# EasyEDA Pro project TY_FC_CONTRAL_9.eprj

# Schematic Schematic1
Board Name: Board1; Create Date: 2026-02-12; Page Name: P1; Project Name: TY_FC_CONTRAL_9; Schematic Name: Schematic1; Update Date: 2026-04-08; Company: 嘉立创EDA; Page Size: A4; Version: V1.0
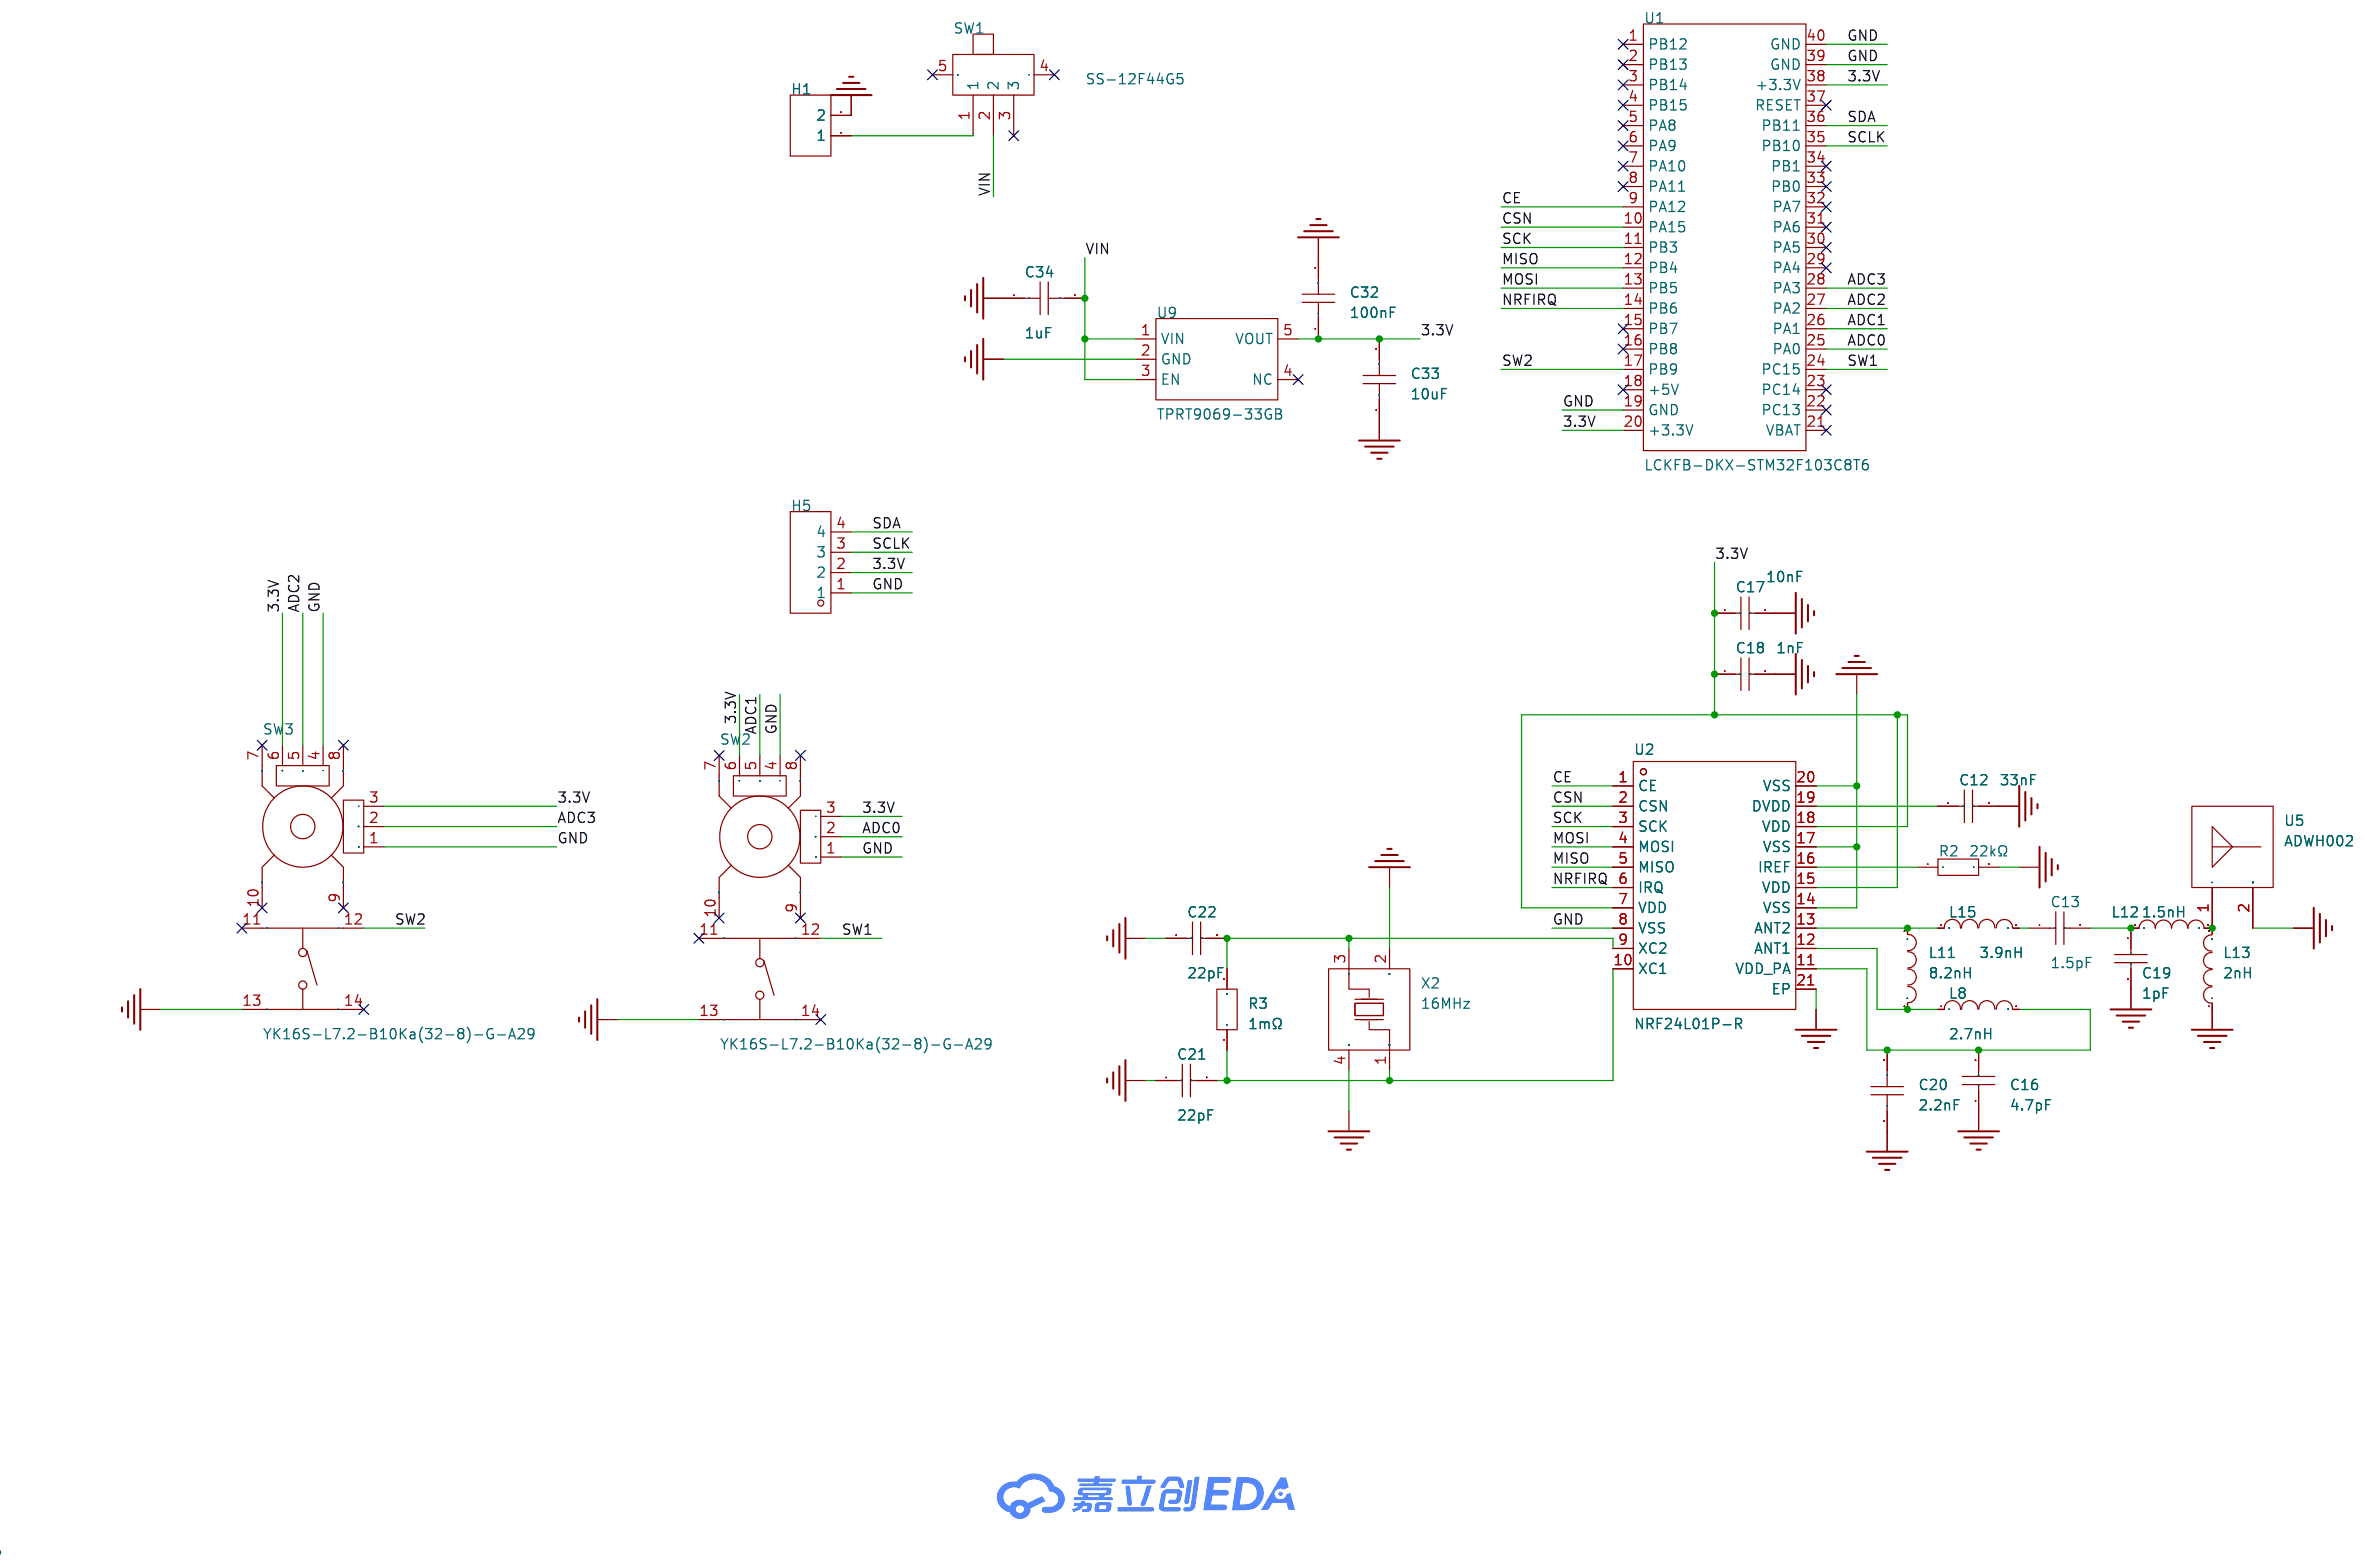
[diagram p0: schematic sheet]

## Parts
C12  33nF  [C0603]
C13  1.5pF  [C0603]
C16  4.7pF  [C0603]
C17  10nF  [C0603]
C18  1nF  [C0603]
C19  1pF  [C0603]
C20  2.2nF  [C0603]
C21  22pF  [C0603]
C22  22pF  [C0603]
C32  100nF  [C0603]
C33  10uF  [C0603]
C34  1uF  [C0603]
H1  -  [HDR-TH_2P-P2.54-V-F]
H5  -  [HDR-TH_4P-P2.54-V-F]
L8  2.7nH  [L0402]
L11  8.2nH  [L0402]
L12  1.5nH  [L0603]
L13  2nH  [L0603]
L15  3.9nH  [L0402]
R2  22kΩ  [R0603]
R3  1mΩ  [R0603]
SW1  SS-12F44G5  [SW-TH_SS-12F44G5]
SW2  YK16S-L7.2-B10Ka(32-8)-G-A29  [JOYTICK-TH_YF16S-FL7.2-B5KB-45-10-Y_1]
SW3  YK16S-L7.2-B10Ka(32-8)-G-A29  [JOYTICK-TH_YF16S-FL7.2-B5KB-45-10-Y_1]
U1  LCKFB-DKX-STM32F103C8T6  [CONN-TH_L53.3-W22.9_STM32F103C8T6-CARD]
U2  NRF24L01P-R  [QFN-20_L4.0-W4.0-P0.50-BL-EP]
U5  ADWH002  [ANT-SMD_L5.0-W2.0_HM5B]
U9  TPRT9069-33GB  [SOT-23-5_L3.0-W1.7-P0.95-LS2.8-BR]
X2  16MHz  [OSC-SMD_4P-L3.2-W2.5-BL]

## Library data of the parts
C12 = CL10B333KB8NNNC: 容值:33nF;精度:±10%;额定电压:50V;温度系数:X7R;; LCSC Part Name: 33nF ±10% 50V; Supplier Part: C21117; Manufacturer: SAMSUNG(三星); Supplier Footprint: 0603; JLCPCB Part Class: 基础库; Datasheet: https://item.szlcsc.com/datasheet/CL10B333KB8NNNC/21829.html; Supplier: LCSC; Tolerance: ±10%; Voltage Rating: 50V; Temperature Coefficient: X7R
C13 = 0603CG1R5C500NT: 容值:1.5pF;额定电压:50V;温度系数:C0G;; LCSC Part Name: ±0.25pF 1.5pF 50V; Supplier Part: C1639; Manufacturer: FH(风华); Supplier Footprint: 0603; JLCPCB Part Class: 扩展库; Datasheet: https://item.szlcsc.com/datasheet/0603CG1R5C500NT/1991.html; Supplier: LCSC; Voltage Rating: 50V; Temperature Coefficient: C0G
C16 = 0603CG4R7C500NT: 容值:4.7pF;额定电压:50V;温度系数:C0G;; LCSC Part Name: ±0.25pF 4.7pF 50V; Supplier Part: C1669; Manufacturer: FH(风华); Supplier Footprint: 0603; JLCPCB Part Class: 扩展库; Datasheet: https://item.szlcsc.com/datasheet/0603CG4R7C500NT/2021.html; Supplier: LCSC; Voltage Rating: 50V; Temperature Coefficient: C0G
C17 = CC0603KRX7R9BB103: 容值:10nF;精度:±10%;额定电压:50V;温度系数:X7R;; LCSC Part Name: 10nF ±10% 50V; Supplier Part: C100042; Manufacturer: YAGEO(国巨); Supplier Footprint: 0603; JLCPCB Part Class: 扩展库; Datasheet: https://item.szlcsc.com/datasheet/CC0603KRX7R9BB103/101256.html; Supplier: LCSC; Tolerance: ±10%; Voltage Rating: 50V; Temperature Coefficient: X7R
C18 = CL10B102KB8NNNC: 容值:1nF;精度:±10%;额定电压:50V;温度系数:X7R;; LCSC Part Name: 1nF ±10% 50V; Supplier Part: C1588; Manufacturer: SAMSUNG(三星); Supplier Footprint: 0603; JLCPCB Part Class: 基础库; Datasheet: https://item.szlcsc.com/datasheet/CL10B102KB8NNNC/1940.html; Supplier: LCSC; Tolerance: ±10%; Voltage Rating: 50V; Temperature Coefficient: X7R
C19 = 0603CG1R0C500NT: LCSC Part Name: ±0.25pF 1pF 50V; Supplier Part: C37117; Manufacturer: FH(风华); Supplier Footprint: 0603; JLCPCB Part Class: 扩展库; Datasheet: https://item.szlcsc.com/datasheet/0603CG1R0C500NT/38096.html; Supplier: LCSC; Voltage Rating: 50V; Temperature Coefficient: C0G
C20 = FCC0603B222K500CT: LCSC Part Name: 2.2nF ±10% 50V; Supplier Part: C5137562; Manufacturer: FOJAN(富捷); Supplier Footprint: 0603; JLCPCB Part Class: 扩展库; Datasheet: https://item.szlcsc.com/datasheet/FCC0603B222K500CT/5747014.html; Supplier: LCSC; Tolerance: ±10%; Voltage Rating: 50V; Temperature Coefficient: X7R
C21 C22 = CL10C220JB8NNNC: LCSC Part Name: 22pF ±5% 50V; Supplier Part: C1653; Manufacturer: SAMSUNG(三星); Supplier Footprint: 0603; JLCPCB Part Class: 基础库; Datasheet: https://item.szlcsc.com/datasheet/CL10C220JB8NNNC/2005.html; Supplier: LCSC; Tolerance: ±5%; Voltage Rating: 50V; Temperature Coefficient: C0G
C32 = CC0603KRX7R9BB104: 容值:100nF;精度:±10%;额定电压:50V;温度系数:X7R;; LCSC Part Name: 100nF ±10% 50V; Supplier Part: C14663; Manufacturer: YAGEO(国巨); Supplier Footprint: 0603; JLCPCB Part Class: 基础库; Datasheet: https://item.szlcsc.com/datasheet/CC0603KRX7R9BB104/15331.html; Supplier: LCSC; Tolerance: ±10%; Voltage Rating: 50V; Temperature Coefficient: X7R
C33 = CGA0603X5R106K100JT: 容值:10uF;精度:±10%;额定电压:10V;温度系数:X5R;; LCSC Part Name: 10uF ±10% 10V; Supplier Part: C6119842; Manufacturer: HRE(芯声); Supplier Footprint: 0603; JLCPCB Part Class: 扩展库; Datasheet: https://item.szlcsc.com/datasheet/CGA0603X5R106K100JT/7062548.html; Supplier: LCSC; Tolerance: ±10%; Voltage Rating: 10V; Temperature Coefficient: X5R
C34 = CGA0603X5R105K500JT: 容值:1uF;精度:±10%;额定电压:50V;温度系数:X5R;; LCSC Part Name: 1uF ±10% 50V; Supplier Part: C6119852; Manufacturer: HRE(芯声); Supplier Footprint: 0603; JLCPCB Part Class: 扩展库; Datasheet: https://item.szlcsc.com/datasheet/CGA0603X5R105K500JT/7062558.html; Supplier: LCSC; Tolerance: ±10%; Voltage Rating: 50V; Temperature Coefficient: X5R
H1 = HDR-F_2.54_1x2P: Supplier Part: C49661; Supplier Footprint: 插件
H5 = HDR-F_2.54_1x4P: Supplier Part: C2718488; Supplier Footprint: 插件
L8 = LQG15HS2N7S02D: 电感值:2.7nH;精度:-;额定电流:800mA;饱和电流(Isat):-;直流电阻(DCR):120mΩ;; LCSC Part Name: ±0.3nH 2.7nH; Supplier Part: C77108; Manufacturer: muRata(村田); Supplier Footprint: 0402; JLCPCB Part Class: 扩展库; Datasheet: https://item.szlcsc.com/datasheet/LQG15HS2N7S02D/78235.html; Supplier: LCSC; Current Rating: 800mA; DC Resistance(DCR): 120mΩ; Q @ Frequency: 8@100MHz; Frequency - Self Resonant: 6GHz
L11 = SDCL1005C8N2JTDF: 电感值:8.2nH;精度:±5%;额定电流:300mA;饱和电流(Isat):-;直流电阻(DCR):400mΩ;; LCSC Part Name: 8.2nH ±5%; Supplier Part: C16208; Manufacturer: Sunlord(顺络); Supplier Footprint: 0402; JLCPCB Part Class: 扩展库; Datasheet: https://item.szlcsc.com/datasheet/SDCL1005C8N2JTDF/16890.html; Supplier: LCSC; Tolerance: ±5%; Current Rating: 300mA; DC Resistance(DCR): 400mΩ; Q @ Frequency: 8@100MHz; Frequency - Self Resonant: 3.6GHz
L12 = LQG18HN1N5S00D: LCSC Part Name: 1.5nH ±0.3nH; Supplier Part: C882495; Manufacturer: muRata(村田); Supplier Footprint: 0603; JLCPCB Part Class: 扩展库; Datasheet: https://atta.szlcsc.com/upload/public/pdf/source/20201228/C882495_224F3764FCADED3FCD37F8C25FAFFA7A.pdf; Supplier: LCSC; Rated Current: 1.1A; DC Resistance (DCR): 100mΩ; Q @ Freq: 12@100MHz; Frequency - Self Resonant: 6GHz; Type: 叠层电感
L13 = SDCL1608C2N0STDF: Supplier Part: C370234; Manufacturer: Sunlord(顺络); Supplier Footprint: 0603; JLCPCB Part Class: Extended Part; Datasheet: https://item.szlcsc.com/datasheet/SDCL1608C2N0STDF/343985.html; Supplier: LCSC
L15 = SDCL1005C3N9STDF: LCSC Part Name: ±0.3nH 3.9nH; Supplier Part: C14033; Manufacturer: Sunlord(顺络); Supplier Footprint: 0402; JLCPCB Part Class: 扩展库; Datasheet: https://item.szlcsc.com/datasheet/SDCL1005C3N9STDF/14690.html; Supplier: LCSC; Current Rating: 300mA; DC Resistance(DCR): 200mΩ; Q @ Frequency: 8@100MHz; Frequency - Self Resonant: 4GHz
R2 = 0603WAF2202T5E: 电阻类型:厚膜电阻;阻值:22kΩ;精度:±1%;功率:100mW;工作电压:75V;温度系数:±100ppm/℃;; LCSC Part Name: 22kΩ ±1% 100mW 厚膜电阻; Supplier Part: C31850; Manufacturer: UNI-ROYAL(厚声); Supplier Footprint: 0603; JLCPCB Part Class: 基础库; Datasheet: https://item.szlcsc.com/datasheet/0603WAF2202T5E/32812.html; Supplier: LCSC; Type: 厚膜电阻; Tolerance: ±1%; Power(Watts): 100mW; Voltage-Supply(Max): 75V; Temperature Coefficient: ±100ppm/℃; Operating Temperature: -55℃~+155℃
R3 = PA0603FRP070R001L: LCSC Part Name: 1mΩ ±1% 100mW; Supplier Part: C6949223; Manufacturer: YAGEO(国巨); Supplier Footprint: 0603; JLCPCB Part Class: 扩展库; Datasheet: https://item.szlcsc.com/datasheet/PA0603FRP070R001L/7915052.html; Supplier: LCSC; Tolerance: ±1%; Power(Watts): 100mW; Temperature Coefficient: ±300ppm/℃; Operating Temperature: -55℃~+155℃
SW1 = SS-12F44G5: Supplier Part: C22355757; Manufacturer: SOFNG(硕方); Supplier Footprint: SIP-3P,12.2x5.8mm; JLCPCB Part Class: 扩展库; Datasheet: https://item.szlcsc.com/datasheet/SS-12F44G5/23787638.html; Supplier: LCSC
SW2 SW3 = YK16S-L7.2-B10Ka(32-8)-G-A29: 摇杆电位器、操纵杆电位器，适用于航模玩具遥控器电位器、3D摇杆PS4手柄游戏机、无人机摇杆电位器、VR摇杆电位器、工业控制器; LCSC Part Name: 摇杆系列电位器; Supplier Part: C37323746; Manufacturer: YTL(亚特联); Supplier Footprint: 插件-14P,25.5x20.3mm; JLCPCB Part Class: Extended Part; Datasheet: https://item.szlcsc.com/datasheet/YK16S-L7.2-B10Ka(32-8)-G-A29/39051753.html; Supplier: LCSC; Total Resistance: 10kΩ; Toggle reset: 自复位; Mounting Type: 直插; Operating Temperature: -10℃~+70℃; Voltage Rating: 12V
U1 = LCKFB-DKX-STM32F103C8T6: LCSC Part Name: 立创·地阔星-STM32F103C8T6开发板; Supplier Part: C22396880; Manufacturer: 立创开发板; JLCPCB Part Class: 扩展库; Datasheet: https://item.szlcsc.com/datasheet/LCKFB-DKX-STM32F103C8T6/24005615.html; Supplier: LCSC
U2 = NRF24L01P-R: LCSC Part Name: 单芯片2.4GHz收发器; Supplier Part: C8791; Manufacturer: NORDIC; Supplier Footprint: QFN-20-EP(4x4); JLCPCB Part Class: Extended Part; Datasheet: https://item.szlcsc.com/datasheet/NRF24L01P-R/9305.html; Supplier: LCSC; Frequency Range: 2.4GHz~2.525GHz; Interface: SPI; Voltage - Supply: 1.9V~3.6V; Applications: ISM; Output Power: 0dBm; Data Rate: 2Mbps; Current Of Transmitting: 11.3mA; Sensitivity: -82dBm; Receive Current: 13.5mA; Typical Application Frequency: 2.4GHz; Operating Temperature: -40℃~+85℃; Type: 收发器
U5 = ADWH002: 天线类型:-;中心频率:2.45GHz;带宽:100MHz;增益:0.67dBi;功率:3W;驻波比:2;; LCSC Part Name: 2.4GHz SMD贴片天线 蓝牙/WiFi/zigbee芯片天线 大款; Supplier Part: C22467691; Manufacturer: MyAntenna(摩天射频); Supplier Footprint: SMD; JLCPCB Part Class: 扩展库; Datasheet: https://item.szlcsc.com/datasheet/ADWH002/24170586.html; Supplier: LCSC; Frequency(Center/Band): 2.45GHz; Bandwidth: 100MHz; Peak Gain: 0.67dBi; Impedance: 50Ω; Power: 3W; VSWR: 2; Operating Temperature: -40℃~+85℃; Length: 5mm; Width: 2mm; Height: 1mm
U9 = TPRT9069-33GB: LCSC Part Name: LDO; Supplier Part: C2937034; Manufacturer: TECH PUBLIC(台舟); Supplier Footprint: SOT-23-5; JLCPCB Part Class: 扩展库; Datasheet: https://item.szlcsc.com/datasheet/TPRT9069-33GB/3290381.html; Supplier: LCSC; Output Type: 固定; Voltage - Supply: 36V; Output Voltage: 3.3V; Output Current: 200mA; Power Supply Rejection Ratio (PSRR): 70dB@(100Hz); Voltage Dropout: 750mV@(100mA); standby current: 2uA; Features: 过流保护；过热保护; Operating Temperature: -40℃~+85℃@(Ta); Output Configuration: 正极; Number of Outputs: 1
X2 = X322516MLB4SI: LCSC Part Name: YSX321SL 16MHZ 4P 3225 9PF ±10PPM -40~85℃ (±20PPM); Supplier Part: C13738; Manufacturer: YXC(扬兴晶振); Supplier Footprint: SMD3225-4P; JLCPCB Part Class: 基础库; Datasheet: https://item.szlcsc.com/datasheet/X322516MLB4SI/14393.html; Supplier: LCSC; Type: 贴片晶振; Normal temperature Frequency Tolerance: ±10ppm; Load Capacitance: 9pF; Frequency Stability: ±20ppm; Operating Temperature: -40℃~+85℃

## Nets
3.3V: C17.1 C18.1 C32.1 C33.2 H5.2 SW2.3(A) SW2.6(B) SW3.3(A) SW3.6(B) U1.20(+3.3V) U1.38(+3.3V) U2.7(VDD) U2.15(VDD) U2.18(VDD) U9.5(VOUT)
GND: C12.2 C16.1 C17.2 C18.2 C19.2 C20.1 C21.1 C22.1 C32.2 C33.1 C34.1 H1.2 H5.1 L13.1 R2.2 SW2.1(B) SW2.4(A) SW2.13(c) SW3.1(B) SW3.4(A) SW3.13(c) U1.19(GND) U1.39(GND) U1.40(GND) U2.8(VSS) U2.14(VSS) U2.17(VSS) U2.20(VSS) U2.21(EP) U5.2(GND) U9.2(GND) X2.2(GND) X2.4(GND)
VIN: C34.2 SW1.2 U9.1(VIN) U9.3(EN)
ADC0: SW2.2(DTA) U1.25(PA0)
ADC1: SW2.5(DTA) U1.26(PA1)
ADC2: SW3.5(DTA) U1.27(PA2)
ADC3: SW3.2(DTA) U1.28(PA3)
CE: U1.9(PA12) U2.1(CE)
CSN: U1.10(PA15) U2.2(CSN)
MISO: U1.12(PB4) U2.5(MISO)
MOSI: U1.13(PB5) U2.4(MOSI)
NRFIRQ: U1.14(PB6) U2.6(IRQ)
SCK: U1.11(PB3) U2.3(SCK)
SCLK: H5.3 U1.35(PB10)
SDA: H5.4 U1.36(PB11)
SW1: SW2.12(b) U1.24(PC15)
SW2: SW3.12(b) U1.17(PB9)
$1N1085: C12.1 U2.19(DVDD)
$1N1097: R2.1 U2.16(IREF)
$1N2360: C13.1 L15.2
$1N2475: L11.1 L15.1 U2.13(ANT2)
$1N2479: L8.1 L11.2 U2.12(ANT1)
$1N2577: C16.2 C20.2 L8.2 U2.11(VDD_PA)
$1N2671: C13.2 C19.1 L12.1
$1N3975: H1.1 SW1.1
$1N8605: L12.2 L13.2 U5.1(IN)
$1N14397: C22.2 R3.2 U2.9(XC2) X2.3(OSC2)
$1N14403: C21.2 R3.1 U2.10(XC1) X2.1(OSC1)

Not connected (* = marked no-connect by the designer): SW1 3* 4* 5*; SW2 7(GND)* 8(GND)* 9(GND)* 10(GND)* 11(a)* 14(d)*; SW3 7(GND)* 8(GND)* 9(GND)* 10(GND)* 11(a)* 14(d)*; U1 1(PB12)* 2(PB13)* 3(PB14)* 4(PB15)* 5(PA8)* 6(PA9)* 7(PA10)* 8(PA11)* 15(PB7)* 16(PB8)* 18(+5V)* 21(VBAT)* 22(PC13)* 23(PC14)* 29(PA4)* 30(PA5)* 31(PA6)* 32(PA7)* 33(PB0)* 34(PB1)* 37(RESET)*; U9 4(NC)*

# Board PCB1
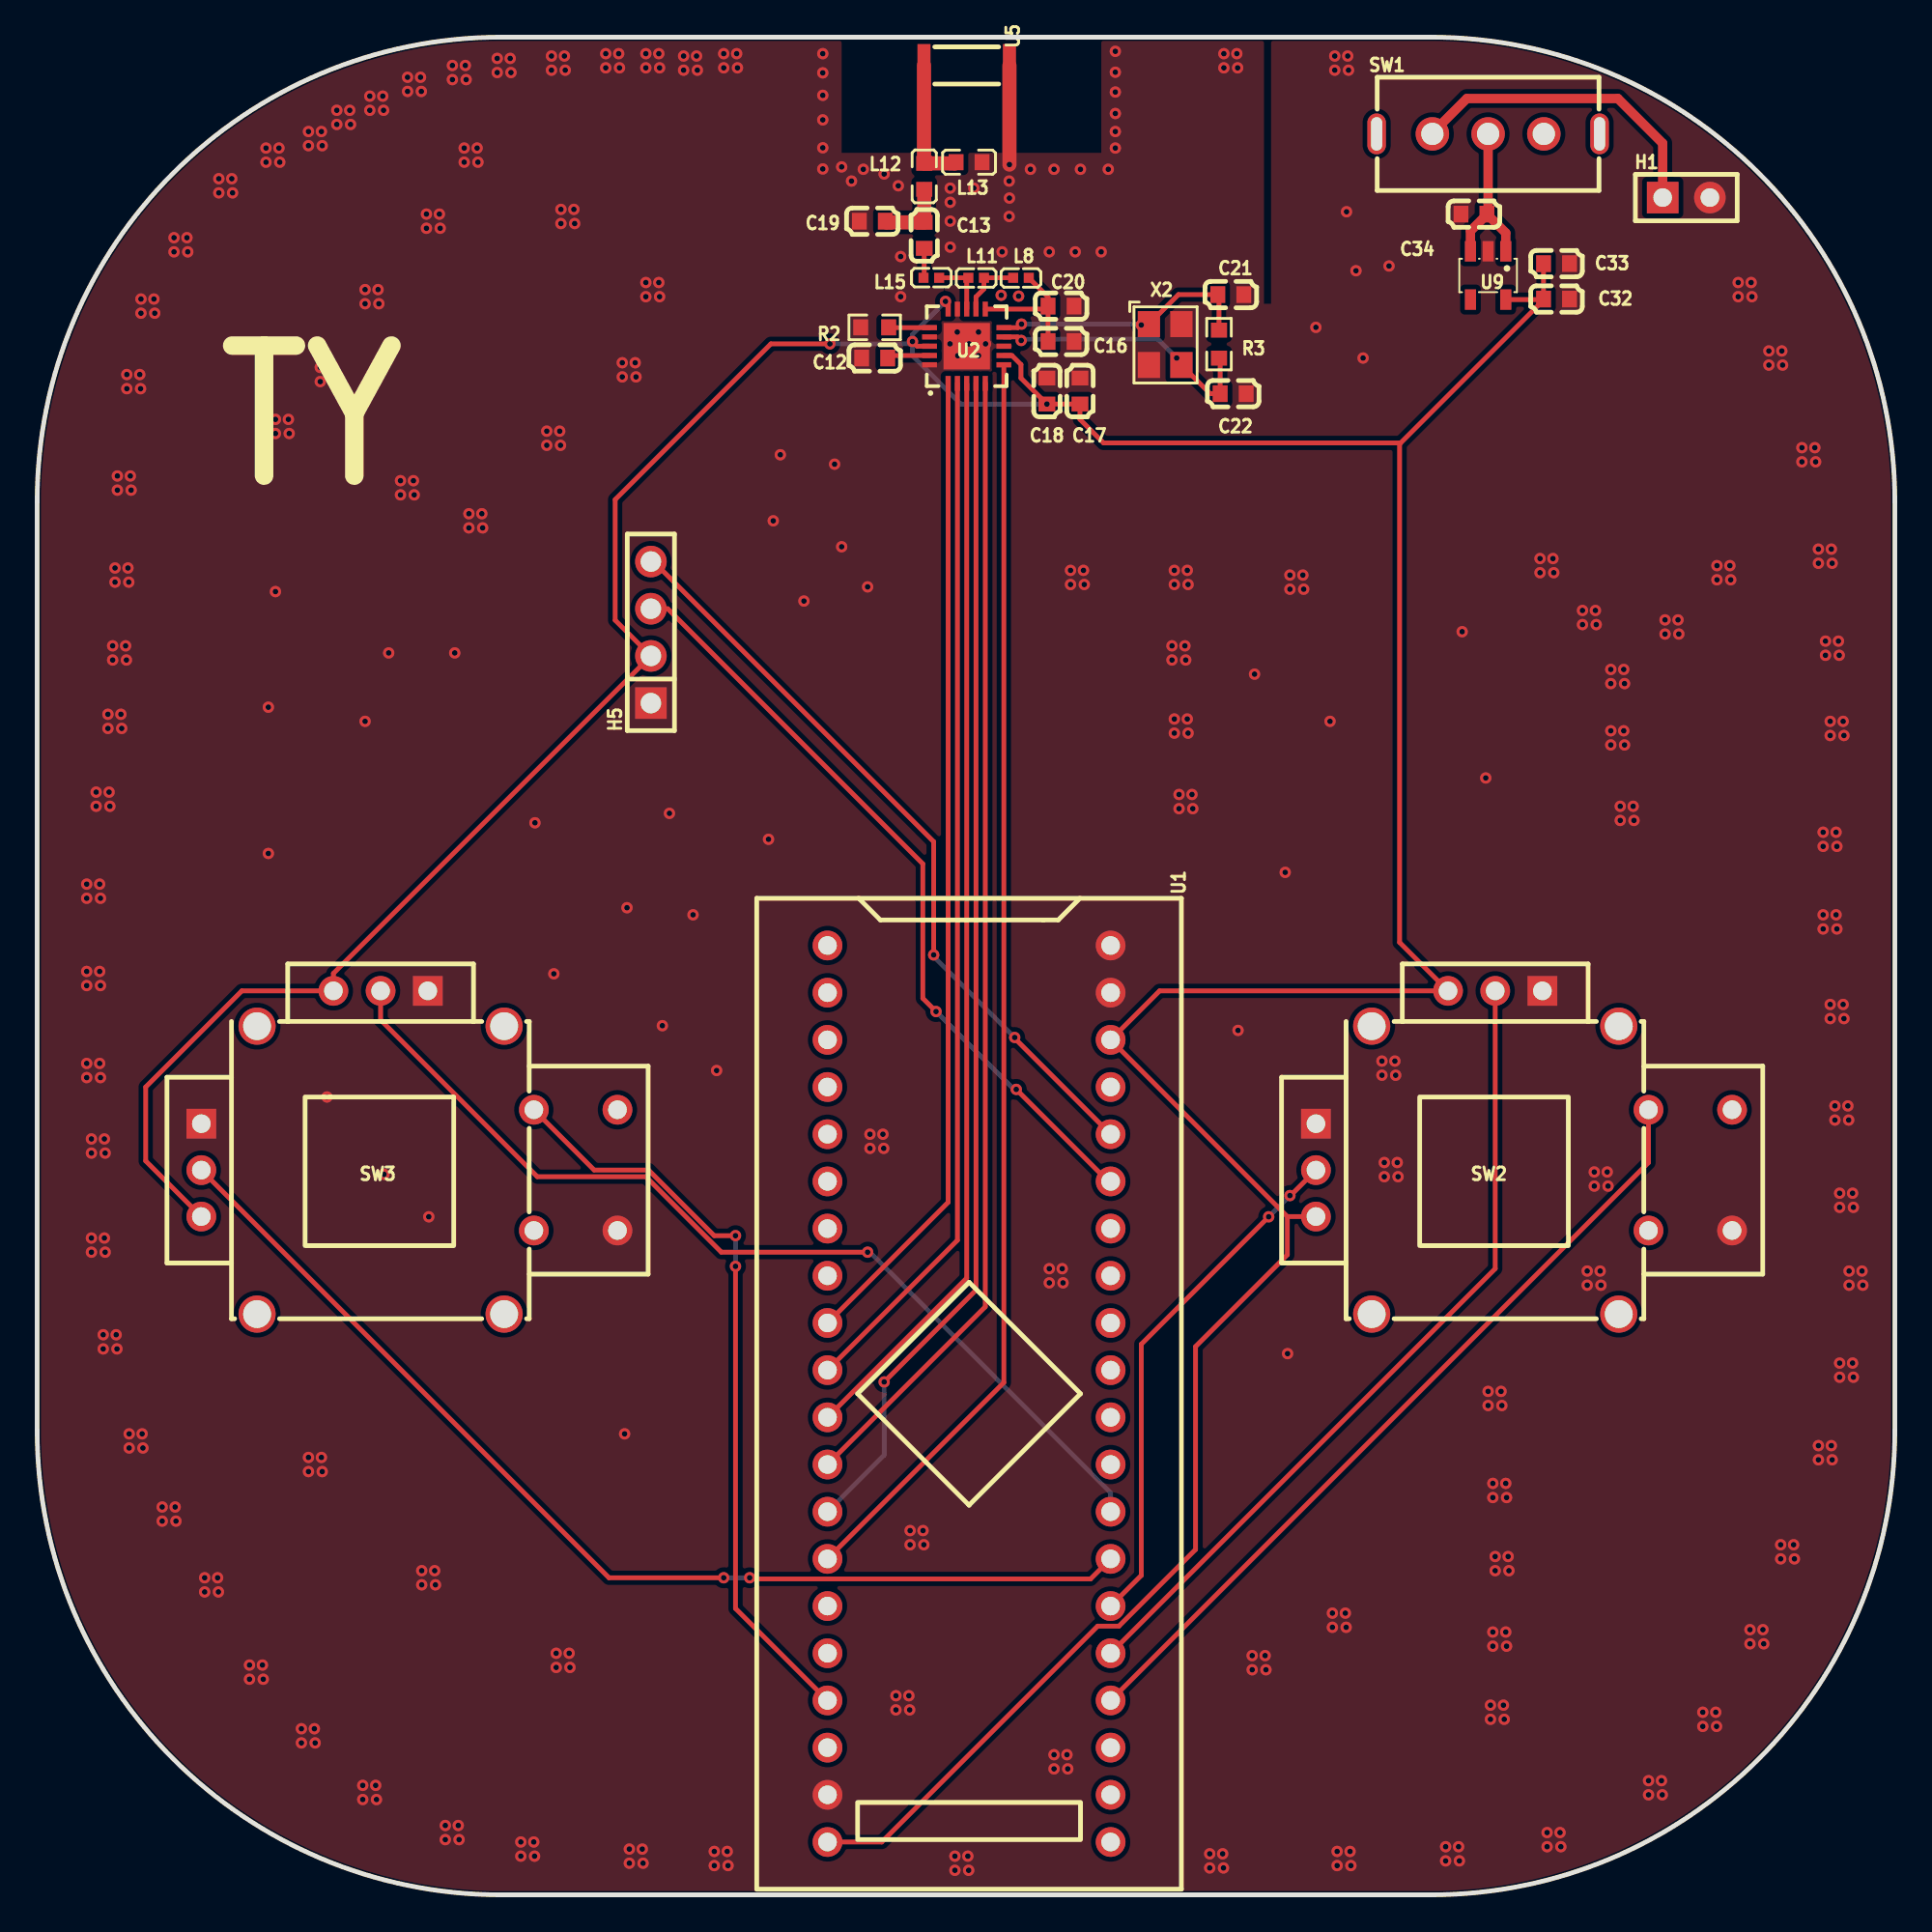
[diagram p1: board, top side]
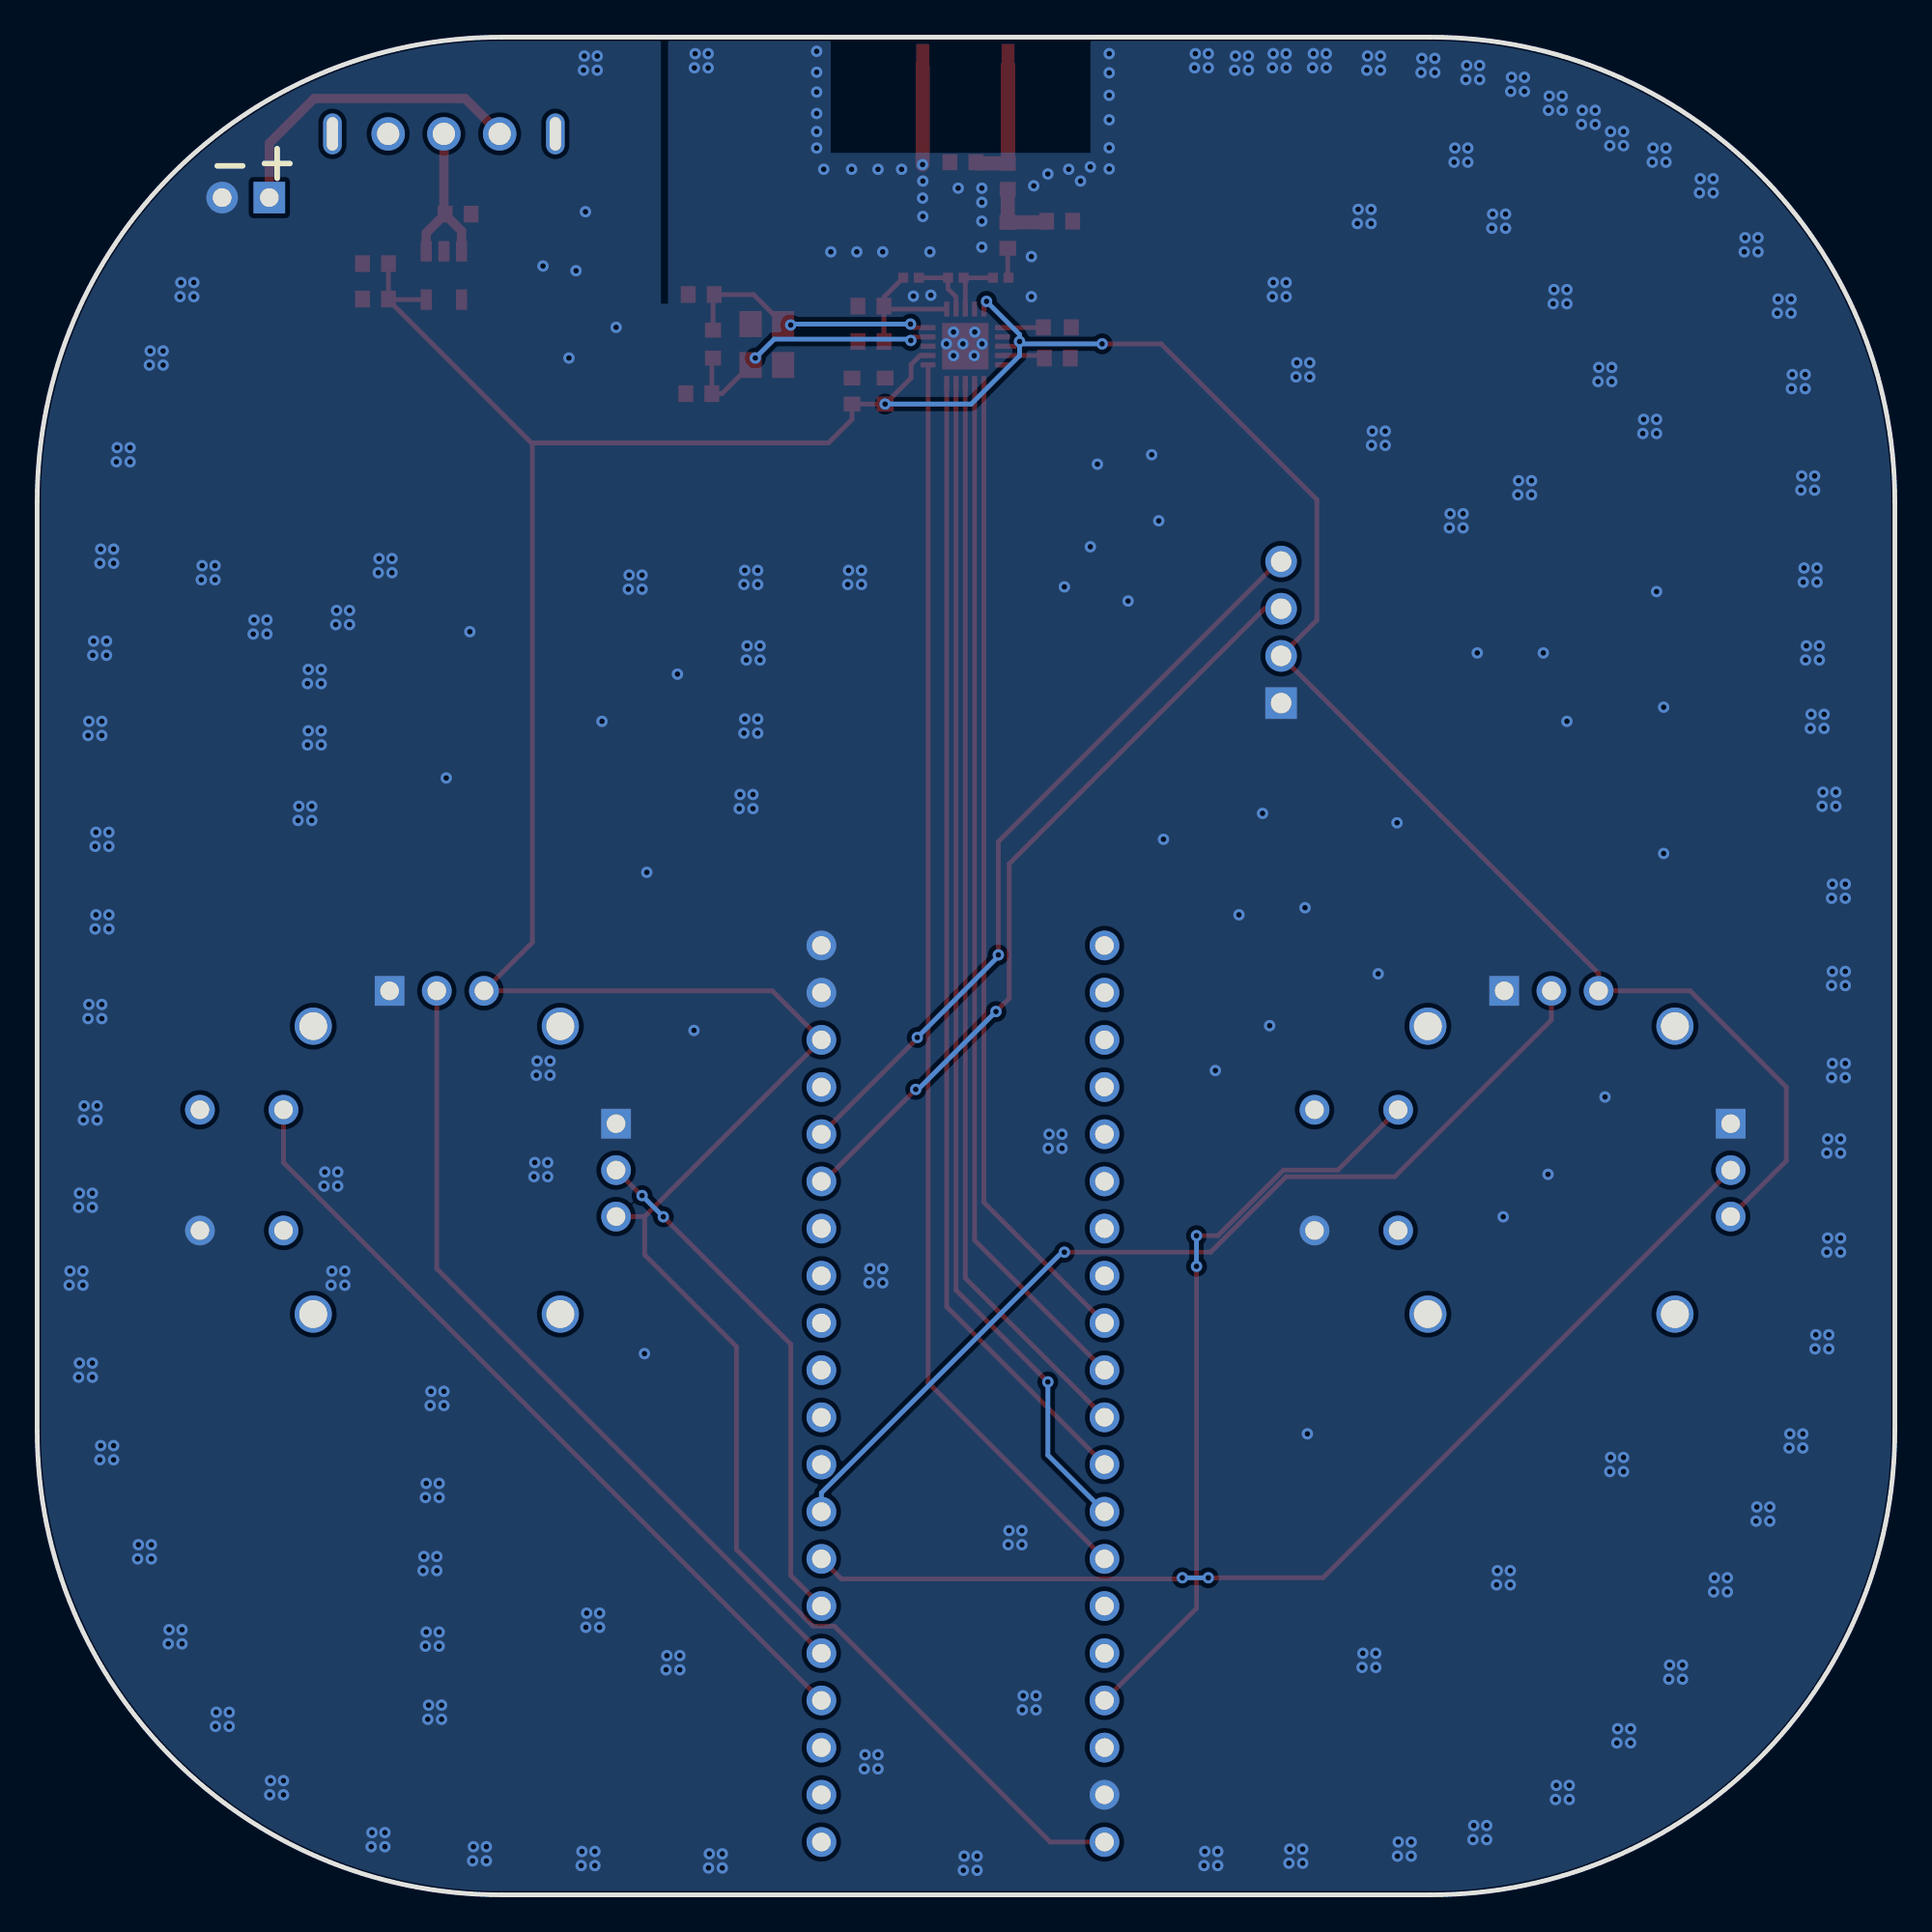
[diagram p2: board, bottom side, seen from below]

Outline 100 x 100 mm; copper layers: Top Layer, Bottom Layer. Coordinates in mm from the lower left corner of the outline.
Outline path: 0,75 0,25 arc(7.32,7.32) 25,0 75,0 arc(92.68,7.32) 100,25 100,75 arc(92.68,92.68) 75,100 25,100 arc(7.32,92.68) 0,75
Stack: Top Layer 0.035mm / Dielectric1 1.51mm FR4 er 4.5 / Bottom Layer 0.035mm

## Design rules (mm)
template: 自定义配置
spacing copperThickness1oz (default): track to track 0.102, other pairs 0.152 to 0.3
spacing copperThickness2oz: track to track 0.203, other pairs 0.152 to 0.3
spacing rf: track to track 0.2, other pairs 0.152 to 0.3
track width copperThickness1oz (default): min 0.127, default 0.254, max 2.54
track width copperThickness2oz: min 0.203, default 0.254, max 2.54
differential pair differentialPair (default): width min 0.127, default 0.254, max 2.54; gap min 0.152, default 0.152
via viaSize (default): diameter min 0.5, default 0.61, max 10; hole min 0.3, default 0.305, max 6.3
net GND uses rf

## Placement (name value [footprint] x y rotation side)
C12  33nF  [C0603]  45.08 82.73 180 top
C13  1.5pF  [C0603]  47.75 89.33 90 top
C16  4.7pF  [C0603]  55.12 83.62 180 top
C17  10nF  [C0603]  56.13 80.95 90 top
C18  1nF  [C0603]  54.36 80.95 90 top
C19  1pF  [C0603]  44.96 90.09 180 top
C20  2.2nF  [C0603]  55.12 85.52 180 top
C21  22pF  [C0603]  64.25 86.14 180 top
C22  22pF  [C0603]  64.38 80.81 180 top
C32  100nF  [C0603]  81.79 85.9 0 top
C33  10uF  [C0603]  81.79 87.81 180 top
C34  1uF  [C0603]  77.34 90.47 0 top
H1  -  [HDR-TH_2P-P2.54-V-F]  88.77 91.36 0 top
H5  -  [HDR-TH_4P-P2.54-V-F]  33.04 67.96 90 top
L8  2.7nH  [L0402]  52.96 87.05 0 top
L11  8.2nH  [L0402]  50.55 87.05 0 top
L12  1.5nH  [L0603]  47.75 92.51 90 top
L13  2nH  [L0603]  50.17 93.27 180 top
L15  3.9nH  [L0402]  48.13 87.05 180 top
R2  22kΩ  [R0603]  45.08 84.38 180 top
R3  1mΩ  [R0603]  63.62 83.48 270 top
SW1  SS-12F44G5  [SW-TH_SS-12F44G5]  78.11 94.79 0 top
SW2  YK16S-L7.2-B10Ka(32-8)-G-A29  [JOYTICK-TH_YF16S-FL7.2-B5KB-45-10-Y_1]  80.04 39.96 180 top
SW3  YK16S-L7.2-B10Ka(32-8)-G-A29  [JOYTICK-TH_YF16S-FL7.2-B5KB-45-10-Y_1]  20.04 39.96 180 top
U1  LCKFB-DKX-STM32F103C8T6  [CONN-TH_L53.3-W22.9_STM32F103C8T6-CARD]  50.17 26.97 270 top
U2  NRF24L01P-R  [QFN-20_L4.0-W4.0-P0.50-BL-EP]  50.04 83.36 0 top
U5  ADWH002  [ANT-SMD_L5.0-W2.0_HM5B]  50.04 98.48 0 top
U9  TPRT9069-33GB  [SOT-23-5_L3.0-W1.7-P0.95-LS2.8-BR]  78.11 87.17 90 top
X2  16MHz  [OSC-SMD_4P-L3.2-W2.5-BL]  60.72 83.45 270 top

## Footprints (pads in the part's own frame, mm; a bottom-side part is the same pattern mirrored in y, then rotated)
ANT-SMD_L5.0-W2.0_HM5B
  rect 0.7x2.3 smd: 1(-2.3,0) 2(2.3,0)
C0603
  rect 0.8x0.9 smd: 1(-0.7,0) 2(0.7,0)
CONN-TH_L53.3-W22.9_STM32F103C8T6-CARD
  round 1.6 hole 1: 1(-24.13,-7.62) 2(-21.59,-7.62) 3(-19.05,-7.62) 4(-16.51,-7.62) 5(-13.97,-7.62) 6(-11.43,-7.62) 7(-8.89,-7.62) 8(-6.35,-7.62) 9(-3.81,-7.62) 10(-1.27,-7.62) 11(1.27,-7.62) 12(3.81,-7.62) 13(6.35,-7.62) 14(8.89,-7.62) 15(11.43,-7.62) 16(13.97,-7.62) 17(16.51,-7.62) 18(19.05,-7.62) 19(21.59,-7.62) 20(24.13,-7.62) 21(24.13,7.62) 22(21.59,7.62) 23(19.05,7.62) 24(16.51,7.62) 25(13.97,7.62) 26(11.43,7.62) 27(8.89,7.62) 28(6.35,7.62) 29(3.81,7.62) 30(1.27,7.62) 31(-1.27,7.62) 32(-3.81,7.62) 33(-6.35,7.62) 34(-8.89,7.62) 35(-11.43,7.62) 36(-13.97,7.62) 37(-16.51,7.62) 38(-19.05,7.62) 39(-21.59,7.62) 40(-24.13,7.62)
HDR-TH_2P-P2.54-V-F
  rect 1.7x1.7 hole 1: 1(-1.27,0)
  round 1.7 hole 1: 2(1.27,0)
HDR-TH_4P-P2.54-V-F
  rect 1.7x1.7 hole 1.1: 1(-3.81,0)
  round 1.7 hole 1.1: 2(-1.27,0) 3(1.27,0) 4(3.81,0)
JOYTICK-TH_YF16S-FL7.2-B5KB-45-10-Y_1
  rect 1.6x1.6 hole 1: 1(-0.99,-8.7) 4(11.2,-1.55)
  round 1.6 hole 1: 2(1.55,-8.7) 3(4.09,-8.7) 5(11.2,0.95) 6(11.2,3.45) 11(-6.7,4.2) 12(-6.7,-2.3) 13(-11.2,4.2) 14(-11.2,-2.3)
  round 2 hole 1.5: 7(8.2,8.7) 8(8.2,-6.8) 9(-5.1,-6.8) 10(-5.1,8.7)
L0402
  rect 0.54x0.54 smd: 1(-0.42,0) 2(0.42,0)
L0603
  rect 0.8x0.864 smd: 1(-0.7,0) 2(0.7,0)
OSC-SMD_4P-L3.2-W2.5-BL
  rect 1.4x1.2 smd: 1(-1.1,-0.875) 2(1.1,-0.875) 3(1.1,0.875) 4(-1.1,0.875)
QFN-20_L4.0-W4.0-P0.50-BL-EP
  rect 0.28x0.8 smd: 1(-1,-2) 2(-0.5,-2) 3(0,-2) 4(0.5,-2) 5(1,-2) 11(1,2) 12(0.5,2) 13(0,2) 14(-0.5,2) 15(-1,2)
  rect 0.8x0.28 smd: 6(2,-1) 7(2,-0.5) 8(2,0) 9(2,0.5) 10(2,1) 16(-2,1) 17(-2,0.5) 18(-2,0) 19(-2,-0.5) 20(-2,-1)
  rect 2.5x2.5 smd: 21(0,0)
R0603
  rect 0.806x0.864 smd: 1(-0.753,0) 2(0.753,0)
SOT-23-5_L3.0-W1.7-P0.95-LS2.8-BR
  rect 1.1x0.6 smd: 1(1.3,-0.95) 2(1.3,0) 3(1.3,0.95) 4(-1.3,0.95) 5(-1.3,-0.95)
SW-TH_SS-12F44G5
  round 1.8 hole 1.2: 1(-3,0) 2(0,0) 3(3,0)
  oval 1x2.2 hole 0.6x1.8: 4(6,0) 5(-6,0)

## Nets
As in the schematic.

Pads without a net: SW1 3 4 5; SW2 7 8 9 10 11 14; SW3 7 8 9 10 11 14; U1 1 2 3 4 5 6 7 8 15 16 18 21 22 23 29 30 31 32 33 34 37; U9 4

## Via types
v1: diameter 0.61, hole 0.305, Top Layer to Bottom Layer, 521 vias

## Routing (per net, layer and track width the routed paths; a pad name or vN(x,y) marks a point on that pad's centre or on a via; arc(x,y) is an arc through that point)
3.3V: length 237.5
  Top Layer w0.254: 73.34,78.16 73.34,51.27 SW2.3 60.42,48.66 U1.38 67.3,36.51 ; 73.34,78.16 57.4,78.16 56.13,79.43 C17.1 v1(54.36,80.25) 52.96,81.65 52.96,82.38 52.47,82.86 U2.7 ; 73.34,78.16 73.39,78.16 81.06,85.82 81.06,85.87 ; 81.06,85.87 U9.5 ; 81.06,85.87 C32.1 C33.2 ; v1(47.12,83.62) 47.37,83.36 U2.18 ; 67.3,36.51 67.3,34.46 62.36,29.51 62.36,18.59 58.23,14.47 57.09,14.47 45.47,2.84 U1.20 ; 67.3,36.51 SW2.6 ; v1(42.67,83.49) 39.5,83.49 31.11,75.11 31.11,68.61 H5.2 15.95,49.6 SW3.3 11.02,48.66 5.84,43.48 5.84,39.51 SW3.6
  Bottom Layer w0.254: v1(42.67,83.49) 46.99,83.49 v1(47.12,83.62) ; v1(47.12,83.62) 47.12,82.85 49.72,80.25 v1(54.36,80.25) ; v1(47.12,83.62) 47.12,84 v1(48.89,85.78)
GND: length 8.3
  Top Layer w0.254: v1(50.67,84.12) 50.67,84 U2.21 ; U2.21 50.17,83.36 v1(50.67,82.85) ; U2.21 v1(50.17,83.49) v1(49.53,84.12)
  Top Layer w0.76: U5.2 v1(52.34,93.14)
  vias: v1(2.67,54.41) v1(2.67,53.64) v1(2.67,49.71) v1(2.67,48.95) v1(2.67,44.75) v1(2.67,43.99) v1(2.92,40.69) v1(2.92,39.93) v1(2.92,35.36) v1(2.92,34.59) v1(3.17,59.36) v1(3.17,58.6) v1(3.36,54.41) v1(3.36,49.71) v1(3.36,44.75) v1(3.41,53.64) v1(3.41,48.95) v1(3.41,43.99) v1(3.56,30.15) v1(3.56,29.39) v1(3.62,40.69) v1(3.66,39.93) v1(3.62,35.36) v1(3.66,34.59) v1(3.81,63.55) v1(3.81,62.79) v1(3.87,59.36) v1(3.92,58.6) v1(4.06,67.23) v1(4.06,66.47) v1(4.19,71.42) v1(4.19,70.66) v1(4.25,30.15) v1(4.32,76.38) v1(4.32,75.62) v1(4.3,29.39) v1(4.51,63.55) v1(4.55,62.79) v1(4.76,67.23) v1(4.83,81.84) v1(4.83,81.08) v1(4.89,71.42) v1(4.8,66.47) v1(4.93,70.66) v1(4.95,24.82) v1(4.95,24.05) v1(5.02,76.38) v1(5.06,75.62) v1(5.59,85.9) v1(5.59,85.14) v1(5.52,81.84) v1(5.57,81.08) v1(5.65,24.82) v1(5.69,24.05) v1(6.28,85.9) v1(6.33,85.14) v1(6.73,20.88) v1(6.73,20.12) v1(7.37,89.2) v1(7.37,88.44) v1(7.43,20.88) v1(7.47,20.12) v1(8.06,89.2) v1(8.11,88.44) v1(9.02,17.07) v1(9.02,16.31) v1(9.78,92.38) v1(9.78,91.62) v1(9.71,17.07) v1(9.76,16.31) v1(10.48,92.38) v1(10.52,91.62) v1(11.43,12.37) v1(11.43,11.61) v1(12.13,12.37) v1(12.17,11.61) v1(12.32,94.03) v1(12.32,93.27) v1(12.45,63.93) v1(12.45,56.06) v1(12.83,79.43) v1(12.83,78.66) v1(12.83,70.15) v1(13.02,94.03) v1(13.06,93.27) v1(13.52,79.43) v1(13.57,78.66) v1(14.22,8.94) v1(14.22,8.18) v1(14.6,94.92) v1(14.6,94.16) v1(14.6,23.55) v1(14.6,22.78) v1(14.92,8.94) v1(14.96,8.18) v1(15.24,82.22) v1(15.24,81.46) v1(15.3,94.92) v1(15.35,94.16) v1(15.3,23.55) v1(15.35,22.78) v1(15.6,42.95) v1(15.94,82.22) v1(15.98,81.46) v1(16.13,96.06) v1(16.13,95.3) v1(16.83,96.06) v1(16.87,95.3) v1(17.53,5.89) v1(17.53,5.13) v1(17.65,86.41) v1(17.65,85.65) v1(17.65,63.17) v1(17.91,96.82) v1(17.91,96.06) v1(18.22,5.89) v1(18.27,5.13) v1(18.35,86.41) v1(18.39,85.65) v1(18.6,96.82) v1(18.65,96.06) v1(18.67,38.79) v1(18.92,66.85) v1(19.56,76.12) v1(19.56,75.36) v1(19.94,97.84) v1(19.94,97.08) v1(20.25,76.12) v1(20.3,75.36) v1(20.64,97.84) v1(20.68,97.08) v1(20.7,17.45) v1(20.7,16.69) v1(20.95,90.47) v1(20.95,89.71) v1(21.08,36.5) v1(21.4,17.45) v1(21.44,16.69) v1(21.65,90.47) v1(21.7,89.71) v1(21.97,3.73) v1(21.97,2.97) v1(22.35,98.48) v1(22.35,97.71) v1(22.48,66.85) v1(22.67,3.73) v1(22.71,2.97) v1(22.99,94.03) v1(22.99,93.27) v1(23.05,98.48) v1(23.09,97.71) v1(23.24,74.35) v1(23.24,73.58) v1(23.68,94.03) v1(23.73,93.27) v1(23.94,74.35) v1(23.98,73.58) v1(24.77,98.86) v1(24.77,98.09) v1(25.46,98.86) v1(25.51,98.09) v1(26.03,2.84) v1(26.03,2.08) v1(26.73,2.84) v1(26.78,2.08) v1(26.8,57.71) v1(27.43,78.79) v1(27.43,78.03) v1(27.69,98.98) v1(27.69,98.22) v1(27.81,49.58) v1(27.94,13) v1(27.94,12.24) v1(28.13,78.79) v1(28.17,78.03) v1(28.19,90.73) v1(28.19,89.97) v1(28.38,98.98) v1(28.43,98.22) v1(28.64,13) v1(28.68,12.24) v1(28.89,90.73) v1(28.93,89.97) v1(30.61,99.11) v1(30.61,98.35) v1(31.3,99.11) v1(31.35,98.35) v1(31.5,82.47) v1(31.5,81.71) v1(31.62,24.82) v1(31.75,53.14) v1(31.88,2.46) v1(31.88,1.7) v1(32.19,82.47) v1(32.24,81.71) v1(32.57,2.46) v1(32.62,1.7) v1(32.77,99.11) v1(32.77,98.35) v1(32.77,86.79) v1(32.77,86.03) v1(33.46,99.11) v1(33.46,86.79) v1(33.51,98.35) v1(33.51,86.03) v1(33.65,46.79) v1(34.04,58.22) v1(34.8,98.98) v1(34.8,98.22) v1(35.31,52.76) v1(35.49,98.98) v1(35.54,98.22) v1(36.45,2.34) v1(36.45,1.57) v1(36.58,44.37) v1(36.96,99.11) v1(36.96,98.35) v1(37.15,2.34) v1(37.19,1.57) v1(37.65,99.11) v1(37.7,98.35) v1(39.37,56.82) v1(39.62,73.96) v1(40.01,77.52) v1(41.27,69.65) v1(42.29,99.11) v1(42.29,98.08) v1(42.29,96.87) v1(42.29,95.55) v1(42.29,94.04) v1(42.29,92.9) v1(42.93,77.01) v1(43.31,93.01) v1(43.31,72.57) v1(43.84,92.25) v1(44.47,92.89) v1(44.7,70.41) v1(44.83,40.94) v1(44.83,40.18) v1(45.53,40.94) v1(45.57,40.18) v1(45.59,92.63) v1(46.23,10.72) v1(46.23,9.96) v1(46.36,92) v1(46.48,88.19) v1(46.48,86.03) v1(46.92,10.72) v1(46.97,9.96) v1(46.99,19.61) v1(46.99,18.85) v1(47.69,19.61) v1(47.73,18.85) v1(49.15,91.87) v1(49.15,91.11) v1(49.15,90.09) v1(49.15,88.7) v1(49.14,83.49) v1(49.4,2.08) v1(49.4,1.32) v1(49.56,82.85) v1(50.1,2.08) v1(50.14,1.32) v1(50.42,91.87) v1(51.05,83.49) v1(51.94,88.44) v1(51.89,86.11) v1(52.32,92.25) v1(52.34,91.34) v1(52.32,90.35) v1(52.83,86.06) v1(53.47,92.89) v1(54.48,88.44) v1(54.48,33.71) v1(54.48,32.94) v1(54.74,92.89) v1(54.74,7.54) v1(54.74,6.78) v1(55.18,33.71) v1(55.22,32.94) v1(55.43,7.54) v1(55.48,6.78) v1(55.63,71.3) v1(55.63,70.54) v1(55.88,88.44) v1(56.16,92.89) v1(56.32,71.3) v1(56.37,70.54) v1(57.28,88.44) v1(57.66,92.89) v1(58.04,99.24) v1(58.04,98.11) v1(58.04,97.05) v1(58.04,95.89) v1(58.04,94.92) v1(58.04,94.03) v1(61.09,67.23) v1(61.09,66.47) v1(61.21,71.3) v1(61.21,70.54) v1(61.21,63.3) v1(61.21,62.53) v1(61.47,59.23) v1(61.47,58.47) v1(61.78,67.23) v1(61.83,66.47) v1(61.91,71.3) v1(61.95,70.54) v1(61.91,63.3) v1(61.95,62.53) v1(62.17,59.23) v1(62.21,58.47) v1(63.12,2.21) v1(63.12,1.45) v1(63.88,99.11) v1(63.88,98.35) v1(63.82,2.21) v1(63.86,1.45) v1(64.58,99.11) v1(64.62,98.35) v1(64.64,46.53) v1(65.4,12.88) v1(65.4,12.12) v1(65.53,65.71) v1(66.1,12.88) v1(66.15,12.12) v1(67.18,55.04) v1(67.31,29.13) v1(67.44,71.04) v1(67.44,70.28) v1(68.13,71.04) v1(68.18,70.28) v1(68.83,84.38) v1(69.6,63.17) v1(69.72,15.16) v1(69.72,14.4) v1(69.85,98.98) v1(69.85,98.22) v1(69.98,2.34) v1(69.98,1.57) v1(70.48,90.6) v1(70.42,15.16) v1(70.46,14.4) v1(70.55,98.98) v1(70.59,98.22) v1(70.67,2.34) v1(70.72,1.57) v1(70.99,87.43) v1(71.37,82.73) v1(72.39,44.88) v1(72.39,44.12) v1(72.52,39.42) v1(72.52,38.66) v1(72.77,87.68) v1(73.09,44.88) v1(73.13,44.12) v1(73.21,39.42) v1(73.26,38.66) v1(75.82,2.59) v1(75.82,1.83) v1(76.52,2.59) v1(76.56,1.83) v1(76.71,68) v1(77.98,60.12) v1(78.11,27.1) v1(78.11,26.34) v1(78.23,10.21) v1(78.23,9.45) v1(78.36,22.15) v1(78.36,21.39) v1(78.36,14.15) v1(78.36,13.39) v1(78.49,18.21) v1(78.49,17.45) v1(78.8,27.1) v1(78.85,26.34) v1(78.93,10.21) v1(78.97,9.45) v1(79.06,22.15) v1(79.06,14.15) v1(79.1,21.39) v1(79.18,18.21) v1(79.1,13.39) v1(79.23,17.45) v1(80.9,71.93) v1(80.9,71.17) v1(81.28,3.35) v1(81.28,2.59) v1(81.6,71.93) v1(81.64,71.17) v1(81.98,3.35) v1(82.02,2.59) v1(83.18,69.14) v1(83.18,68.38) v1(83.44,33.58) v1(83.44,32.82) v1(83.88,69.14) v1(83.82,38.91) v1(83.82,38.15) v1(83.93,68.38) v1(84.14,33.58) v1(84.18,32.82) v1(84.52,38.91) v1(84.56,38.15) v1(84.71,65.96) v1(84.71,65.2) v1(84.71,62.66) v1(84.71,61.9) v1(85.22,58.6) v1(85.22,57.84) v1(85.41,65.96) v1(85.45,65.2) v1(85.41,62.66) v1(85.45,61.9) v1(85.91,58.6) v1(85.96,57.84) v1(86.74,6.15) v1(86.74,5.38) v1(87.44,6.15) v1(87.48,5.38) v1(87.63,68.63) v1(87.63,67.87) v1(88.33,68.63) v1(88.37,67.87) v1(89.66,9.83) v1(89.66,9.07) v1(90.36,9.83) v1(90.42,71.55) v1(90.42,70.79) v1(90.4,9.07) v1(91.12,71.55) v1(91.16,70.79) v1(91.57,86.79) v1(91.57,86.03) v1(92.26,86.79) v1(92.2,14.27) v1(92.2,13.51) v1(92.31,86.03) v1(92.9,14.27) v1(92.94,13.51) v1(93.22,83.11) v1(93.22,82.35) v1(93.85,18.85) v1(93.85,18.08) v1(93.92,83.11) v1(93.96,82.35) v1(94.55,18.85) v1(94.59,18.08) v1(95,77.9) v1(95,77.14) v1(95.69,77.9) v1(95.74,77.14) v1(95.89,72.44) v1(95.89,71.68) v1(95.89,24.18) v1(95.89,23.42) v1(96.14,57.2) v1(96.14,56.44) v1(96.14,52.76) v1(96.14,51.99) v1(96.27,67.49) v1(96.27,66.73) v1(96.58,72.44) v1(96.52,63.17) v1(96.52,62.41) v1(96.52,47.93) v1(96.52,47.17) v1(96.58,24.18) v1(96.63,71.68) v1(96.63,23.42) v1(96.77,42.47) v1(96.77,41.71) v1(96.84,57.2) v1(96.88,56.44) v1(96.84,52.76) v1(96.88,51.99) v1(96.96,67.49) v1(97.01,66.73) v1(97.03,37.77) v1(97.03,37.01) v1(97.03,28.63) v1(97.03,27.86) v1(97.22,63.17) v1(97.26,62.41) v1(97.22,47.93) v1(97.26,47.17) v1(97.47,42.47) v1(97.51,41.71) v1(97.54,33.58) v1(97.54,32.82) v1(97.73,37.77) v1(97.77,37.01) v1(97.73,28.63) v1(97.77,27.86) v1(98.23,33.58) v1(98.28,32.82)
VIN: length 9.1
  Top Layer w0.5: SW1.2 78.11,90.54 C34.2 ; 77.15,88.47 77.15,89.57 78.04,90.46 C34.2 ; C34.2 79.05,89.46 U9.1
ADC0: length 44.2
  Top Layer w0.254: SW2.2 78.49,33.71 U1.25
ADC1: length 28.1
  Top Layer w0.254: v1(66.29,36.5) 59.44,29.64 59.44,17.2 U1.26 ; v1(67.44,37.64) 67.47,37.64 SW2.5
  Bottom Layer w0.254: v1(67.44,37.64) v1(66.29,36.5)
ADC2: length 58.5
  Top Layer w0.254: v1(36.96,17.07) 30.78,17.07 SW3.5 ; U1.27 56.71,17.01 38.42,17.01 v1(38.35,17.07)
  Bottom Layer w0.254: v1(36.96,17.07) v1(38.35,17.07)
ADC3: length 52.4
  Top Layer w0.254: SW3.2 18.49,47.09 26.92,38.66 32.77,38.66 36.83,34.59 v1(44.7,34.59)
  Bottom Layer w0.254: v1(44.7,34.59) 44.83,34.59 57.79,21.64 U1.28
CE: length 53.3
  Top Layer w0.254: U2.1 49.04,37.28 U1.9
CSN: length 56
  Top Layer w0.254: U1.10 49.54,35.24 U2.2
MISO: length 61.7
  Top Layer w0.254: U2.5 51.04,31.66 U1.12
MOSI: length 64
  Top Layer w0.254: U2.4 50.54,32.55 v1(45.59,27.61)
  Bottom Layer w0.254: U1.13 45.59,23.67 v1(45.59,27.61)
NRFIRQ: length 68.2
  Top Layer w0.254: U1.14 52.04,27.58 U2.6
SCK: length 58.8
  Top Layer w0.254: U2.3 50.04,33.2 U1.11
SCLK: length 41.8
  Top Layer w0.254: H5.3 33.94,69.23 47.68,55.5 47.68,48.26 v1(48.39,47.55) ; U1.35 57.66,38.4 v1(52.7,43.36)
  Bottom Layer w0.254: v1(48.39,47.55) 52.58,43.36 v1(52.7,43.36)
SDA: length 41.2
  Top Layer w0.254: U1.36 52.62,46.11 v1(52.62,46.15) ; H5.4 33.18,71.77 48.26,56.69 v1(48.26,50.6)
  Bottom Layer w0.254: v1(52.62,46.15) 48.26,50.51 v1(48.26,50.6)
SW1: length 43.8
  Top Layer w0.254: SW2.12 86.74,39.42 U1.24
SW2: length 40.7
  Top Layer w0.254: U1.17 37.59,15.42 v1(37.59,33.83) ; SW3.12 29.98,39.01 32.91,39.01 36.44,35.48 v1(37.59,35.48)
  Bottom Layer w0.254: v1(37.59,35.48) v1(37.59,33.83)
$1N1085: length 2.3
  Top Layer w0.254: U2.19 45.92,82.86 C12.1
$1N1097: length 2.3
  Top Layer w0.254: U2.16 45.73,84.36 45.71,84.38
$1N2360: length 1.6
  Top Layer w0.254: L15.2 47.75,87.08 C13.1
$1N2475: length 3.3
  Top Layer w0.254: U2.13 50.04,86.96 L11.1 L15.1
$1N2479: length 3.4
  Top Layer w0.254: L8.1 L11.2 50.97,86.45 50.54,86.02 U2.12
$1N2577: length 7.3
  Top Layer w0.254: L8.2 54.42,86.01 C20.2 ; C20.2 54.26,85.36 U2.11 ; C20.2 C16.2
$1N2671: length 3.9
  Top Layer w0.76: C19.1 45.72,90.03 C13.2 L12.1
$1N3975: length 17.1
  Top Layer w0.5: H1.1 87.5,94.28 85.09,96.7 76.96,96.7 75.11,94.84 SW1.1
$1N8605: length 7
  Top Layer w0.76: U5.1 47.74,93.22 L12.2 49.4,93.21 L13.2
$1N14397: length 15
  Top Layer w0.254: v1(61.34,82.73) 61.6,82.47 X2.3 63.14,80.81 C22.2 63.68,82.66 R3.2 ; U2.9 52.78,83.86 v1(52.97,83.67)
  Bottom Layer w0.254: v1(61.34,82.73) 60.33,83.74 53.04,83.74 v1(52.97,83.67)
$1N14403: length 14.2
  Top Layer w0.254: v1(59.44,84.51) 59.8,84.51 X2.1 61.43,86.14 C21.2 63.62,86.08 R3.1 ; v1(52.99,84.55) 52.8,84.36 U2.10
  Bottom Layer w0.254: v1(59.44,84.51) 59.39,84.55 v1(52.99,84.55)

## Copper pours and planes (outline as drawn; the poured copper is in the pictures)
GND on Top Layer: -0.25,100.25 100.33,100.25 100.33,0.05 -0.25,0.05
GND on Bottom Layer: -0.25,100.51 100.08,100.51 100.08,0.05 -0.25,0.05

## Text on the board
Bottom Silkscreen Layer: + | -
Top Silkscreen Layer: TY
